# Altium project AUV_PDB_DIP_STM8.PrjPcb
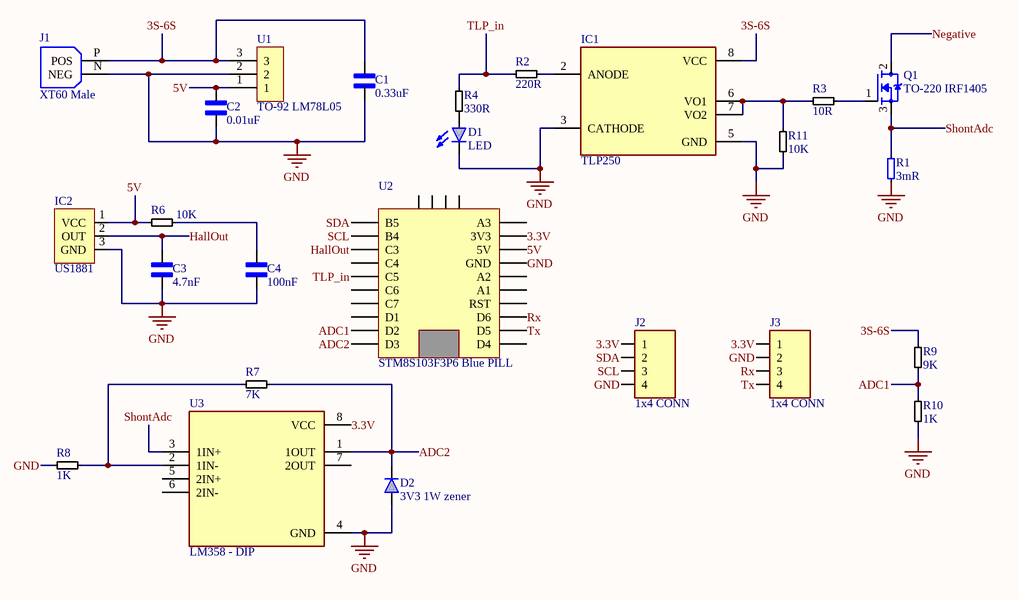
[diagram p0: sch.SchDoc]
1 sheet, 25 parts. Net scope: global (net labels, ports and power ports of the same name join across sheets).
Board file: DIP.PcbDoc

## Sheet sch.SchDoc
size A4; SheetNumber: 1; SheetTotal: 1

### Parts
C1  0.33uF  [CER-DIP-CAP]
C2  0.01uF  [CER-DIP-CAP]
C3  4.7nF  [CER-DIP-CAP]
C4  100nF  [CER-DIP-CAP]
D1  LED  [LED DIP]
D2  3V3 1W zener  [1N4001]
IC1  TLP250  [DIP-8]
IC2  US1881  [UA]
J1  XT60 Male  [XT60 Male Pin]
J2  1x4 CONN  [CON1x4_2.54MM]
J3  1x4 CONN  [CON1x4_2.54MM]
Q1  TO-220 IRF1405  [TO-220]
R1  3mR  [RES 2512 SMD]
R2  220R  [RES DIP]
R3  10R  [RES DIP]
R4  330R  [RES DIP]
R6  10K  [RES DIP]
R7  7K  [RES DIP]
R8  1K  [RES DIP]
R9  9K  [RES DIP]
R10  1K  [RES DIP]
R11  10K  [RES DIP]
U1  TO-92 LM78L05  [TO-226 TO-92]
U2  STM8S103F3P6 Blue PILL  [STM8S103F3P6 BLUE PILL]
U3  LM358 - DIP  [PDIP-8]

### Nets
GND: C1.1 C2.1 C3.1 C4.1 D1.C D2.A(ANODE) IC1.3(CATHODE) IC1.5(GND) IC2.3(GND) J1.N(NEG) J2.4 J3.2 R1.1 R8.2 R10.1 R11.2 U1.2 U2.14(GND) U3.4(GND)
3.3V: J2.1 J3.1 U2.12(3V3) U3.8(VCC)
3S-6S: C1.2 IC1.8(VCC) J1.P(POS) R9.2 U1.3
5V: C2.2 IC2.1(VCC) R6.1 U1.1 U2.13(5V)
ADC1: R9.1 R10.2 U2.9(D2)
ADC2: D2.C(CATHODE) R7.1 U2.10(D3) U3.1(1OUT)
HallOut: C3.2 IC2.2(OUT) U2.3(C3)
Negative: Q1.2(D)
Rx: J3.3 U2.18(D6)
SCL: J2.3 U2.2(B4)
SDA: J2.2 U2.1(B5)
ShontAdc: Q1.3(S) R1.2 U3.3(1IN+)
TLP_in: R2.1 R4.1 U2.5(C5)
Tx: J3.4 U2.19(D5)
NetC4_2: C4.2 R6.2
NetD1_A: D1.A R4.2
NetIC1_2: IC1.2(ANODE) R2.2
NetIC1_6: IC1.6(VO1) IC1.7(VO2) R3.1 R11.1
NetQ1_1: Q1.1(G) R3.2
NetR7_2: R7.2 R8.1 U3.2(1IN-)

Not connected (* = marked no-connect by the designer): U2 4(C4) 6(C6) 7(C7) 8(D1) 11(A3) 15(A2) 16(A1) 17(RST) 20(D4); U3 5(2IN+) 6(2IN-) 7(2OUT)

### Library data of the parts
C1-C4 = CAP DIP
D1 = LED DIP
D2 = 1N4001: Diode
IC1 = TLP250-DIP
J1 = XT60 Male Pin
J2 J3 = CON1x4_2.54mm
Q1 = TO-220 MOSFET
R1 = RES SMD 2512 SHUNT
R2-R4 R6-R11 = RES DIP
U1 = TO-92